# Altium schematic sheet PMW_Bridge.SchDoc
size 209 x 297 mm; DocumentNumber: САНП.*; _Razrabotal: {Разработал}; _Proveril: {Проверил}; _TKontr: {Т.контр}; _NKontr: {Н.контр}; _Utverdil: {Утвердил}
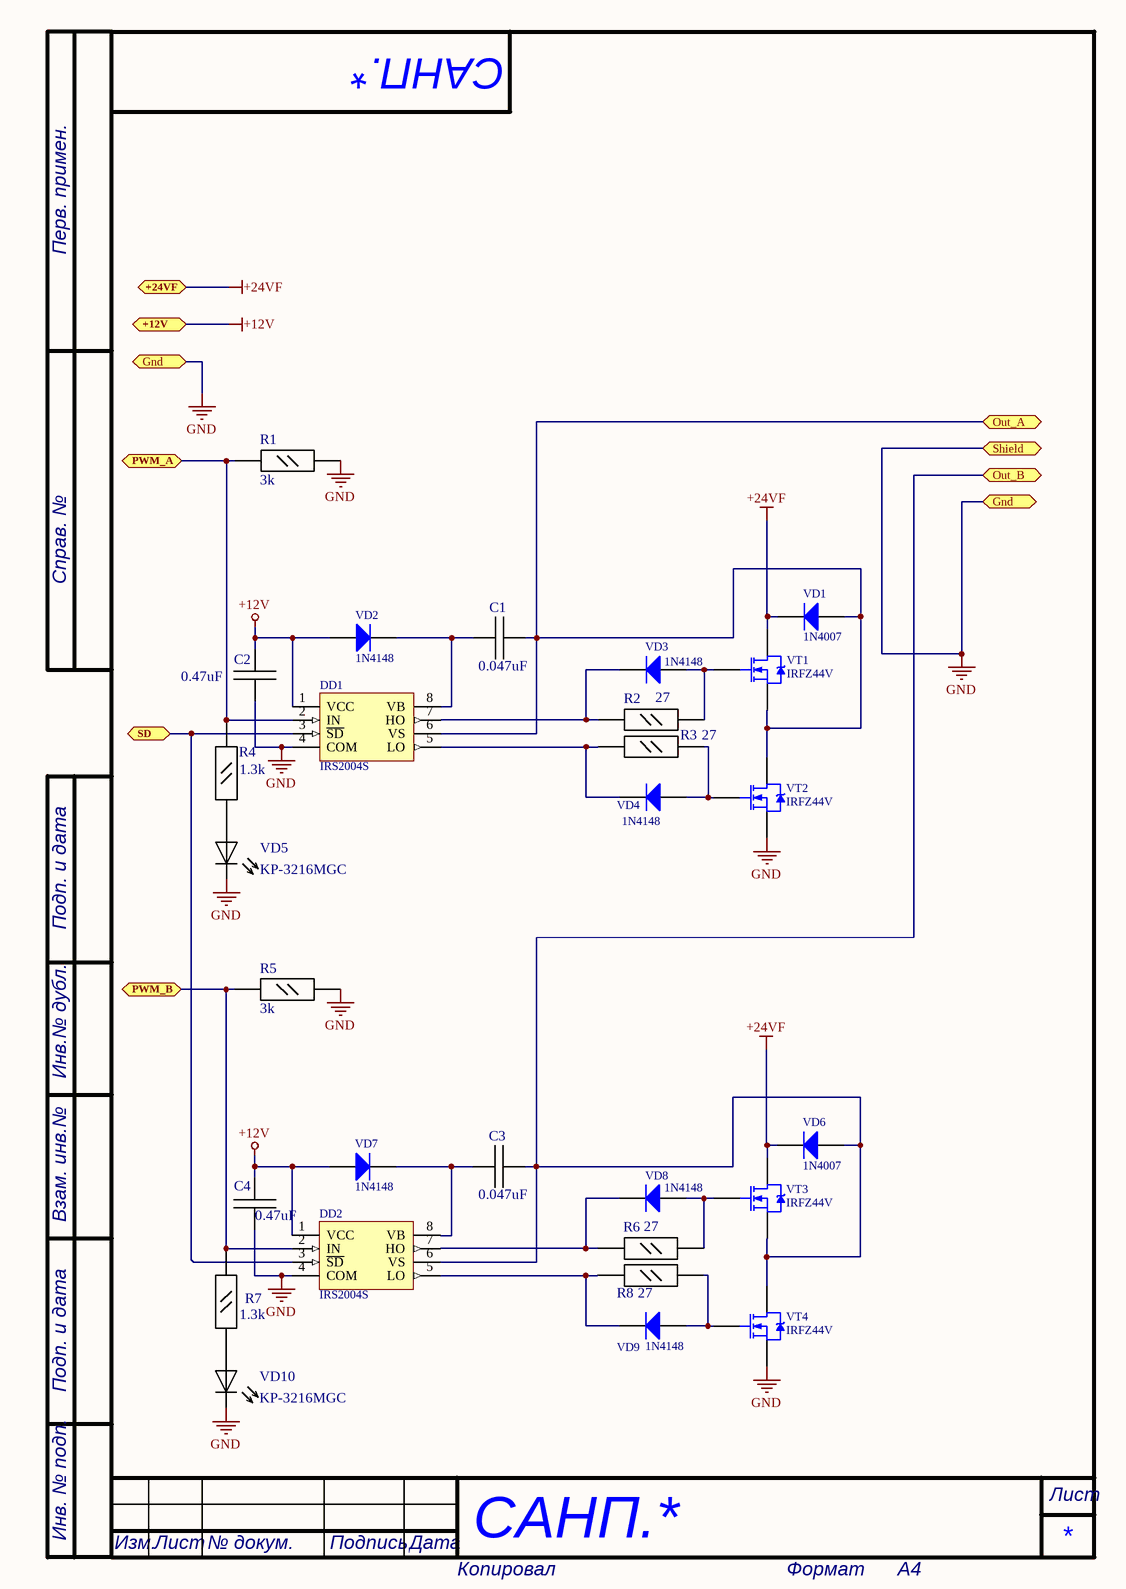
[diagram p0: PMW_Bridge.SchDoc]

## Parts
C1  0.047uF  [0805]
C2  0.47uF  [0805]
C3  0.047uF  [0805]
C4  0.47uF  [0805]
DD1  IRS2004S  [SO-8]
DD2  IRS2004S  [SO-8]
R1  3k  [0805]
R2  27  [0805]
R3  27  [0805]
R4  1.3k  [0805]
R5  3k  [0805]
R6  27  [0805]
R7  1.3k  [0805]
R8  27  [0805]
VD1  1N4007  [DO-41]
VD2  1N4148  [DIODE_DL-35]
VD3  1N4148  [DIODE_DL-35]
VD4  1N4148  [DIODE_DL-35]
VD5  KP-3216MGC  [LED3216]
VD6  1N4007  [DO-41]
VD7  1N4148  [DIODE_DL-35]
VD8  1N4148  [DIODE_DL-35]
VD9  1N4148  [DIODE_DL-35]
VD10  KP-3216MGC  [LED3216]
VT1  IRFZ44V  [TO-220AB]
VT2  IRFZ44V  [TO-220AB]
VT3  IRFZ44V  [TO-220AB]
VT4  IRFZ44V  [TO-220AB]

## Ports
+12V, +24VF, Gnd, Out_A, Out_B, PWM_A, PWM_B, SD, Shield

## Nets
+12V: C2.1 C4.1 DD1.1(VCC) DD2.1(VCC) VD2.1(A) VD7.1(A) ; port +12V
+24VF: VD1.2(K) VD6.2(K) VT1.2(D) VT3.2(D) ; port +24VF
GND: C2.2 C4.2 DD1.4(COM) DD2.4(COM) R1.1 R5.1 VD5.2(K) VD10.2(K) VT2.3(S) VT4.3(S) ; port Shield, port Gnd
Out_A: C1.2 DD1.6(VS) VD1.1(A) VT1.3(S) VT2.2(D) ; port Out_A
Out_B: C3.2 DD2.6(VS) VD6.1(A) VT3.3(S) VT4.2(D) ; port Out_B
PWM_A: DD1.2(IN) R1.2 R4.1 ; port PWM_A
PWM_B: DD2.2(IN) R5.2 R7.1 ; port PWM_B
SD: DD1.3(~{SD}) DD2.3(~{SD}) ; port SD
NetC1_1: C1.1 DD1.8(VB) VD2.2(K)
NetC3_1: C3.1 DD2.8(VB) VD7.2(K)
NetDD1_5: DD1.5(LO) R3.2 VD4.2(K)
NetDD1_7: DD1.7(HO) R2.2 VD3.2(K)
NetDD2_5: DD2.5(LO) R8.2 VD9.2(K)
NetDD2_7: DD2.7(HO) R6.2 VD8.2(K)
NetR2_1: R2.1 VD3.1(A) VT1.1(G)
NetR3_1: R3.1 VD4.1(A) VT2.1(G)
NetR4_2: R4.2 VD5.1(A)
NetR6_1: R6.1 VD8.1(A) VT3.1(G)
NetR7_2: R7.2 VD10.1(A)
NetR8_1: R8.1 VD9.1(A) VT4.1(G)

## Notes on the sheet
- Перв. примен.
- Справ. №
- Подп. и дата
- Инв.№ дубл.
- Взам. инв.№
- Инв. № подп.
- Лист
- Изм.
- № докум.
- Подпись
- Дата
- Копировал
- Формат      А4

## Library data of the parts
C1-C4 = CC0805: Manufacturer: YAGEO; Accuracy: 10%; CVoltage: 50 В; TC Material: X7R; ComponentName: СС0805; PackageName: 0805; ComponentType: Конденсатор
  C1 C3: Value: 0.047uF
  C2 C4: Value: 0.47uF
DD1 DD2 = IRS2004S_small_sch: Драйвер MSFET; ComponentName: IRS2004S; ComponentType: Микросхема; Manufacturer: *; PackageName: SO-8
R1-R8 = RC0805FR: Резистор общего назначения 1%; Manufacturer: YAGEO; PackageName: 0805; ComponentType: Резистор; Accuracy: 1%; ComponentName: RC0805FR
  R1 R5: Value: 3k
  R2 R3 R6 R8: Value: 27
  R4 R7: Value: 1.3k
VD1 VD6 = UN4007: 1 Amp General Purpose Rectifier; PackageName: DO-41; ComponentName: 1N4007; ComponentType: Diode; Manufacturer: *
VD2-VD4 VD7-VD9 = Diode 1N4148: High Conductance Fast Diode; PackageName: DL-35; ComponentName: 1N4148; ComponentType: High Conductance Fast Diode; Manufacturer: *
VD5 VD10 = KP-3216: Светодиод; Manufacturer: Kingbright; ComponentType: Светодиод; ComponentName: KP-3216MGC
VT1-VT4 = IRFZ44V: N-Channel Power MOSFET; PackageName: TO-220AB; ComponentName: IRFZ44V; ComponentType: N-Channel Power MOSFET; Manufacturer: *